# Altium schematic sheet COMMUNICATION.SchDoc
size 420 x 297 mm; SheetNumber: 4; SheetTotal: 7
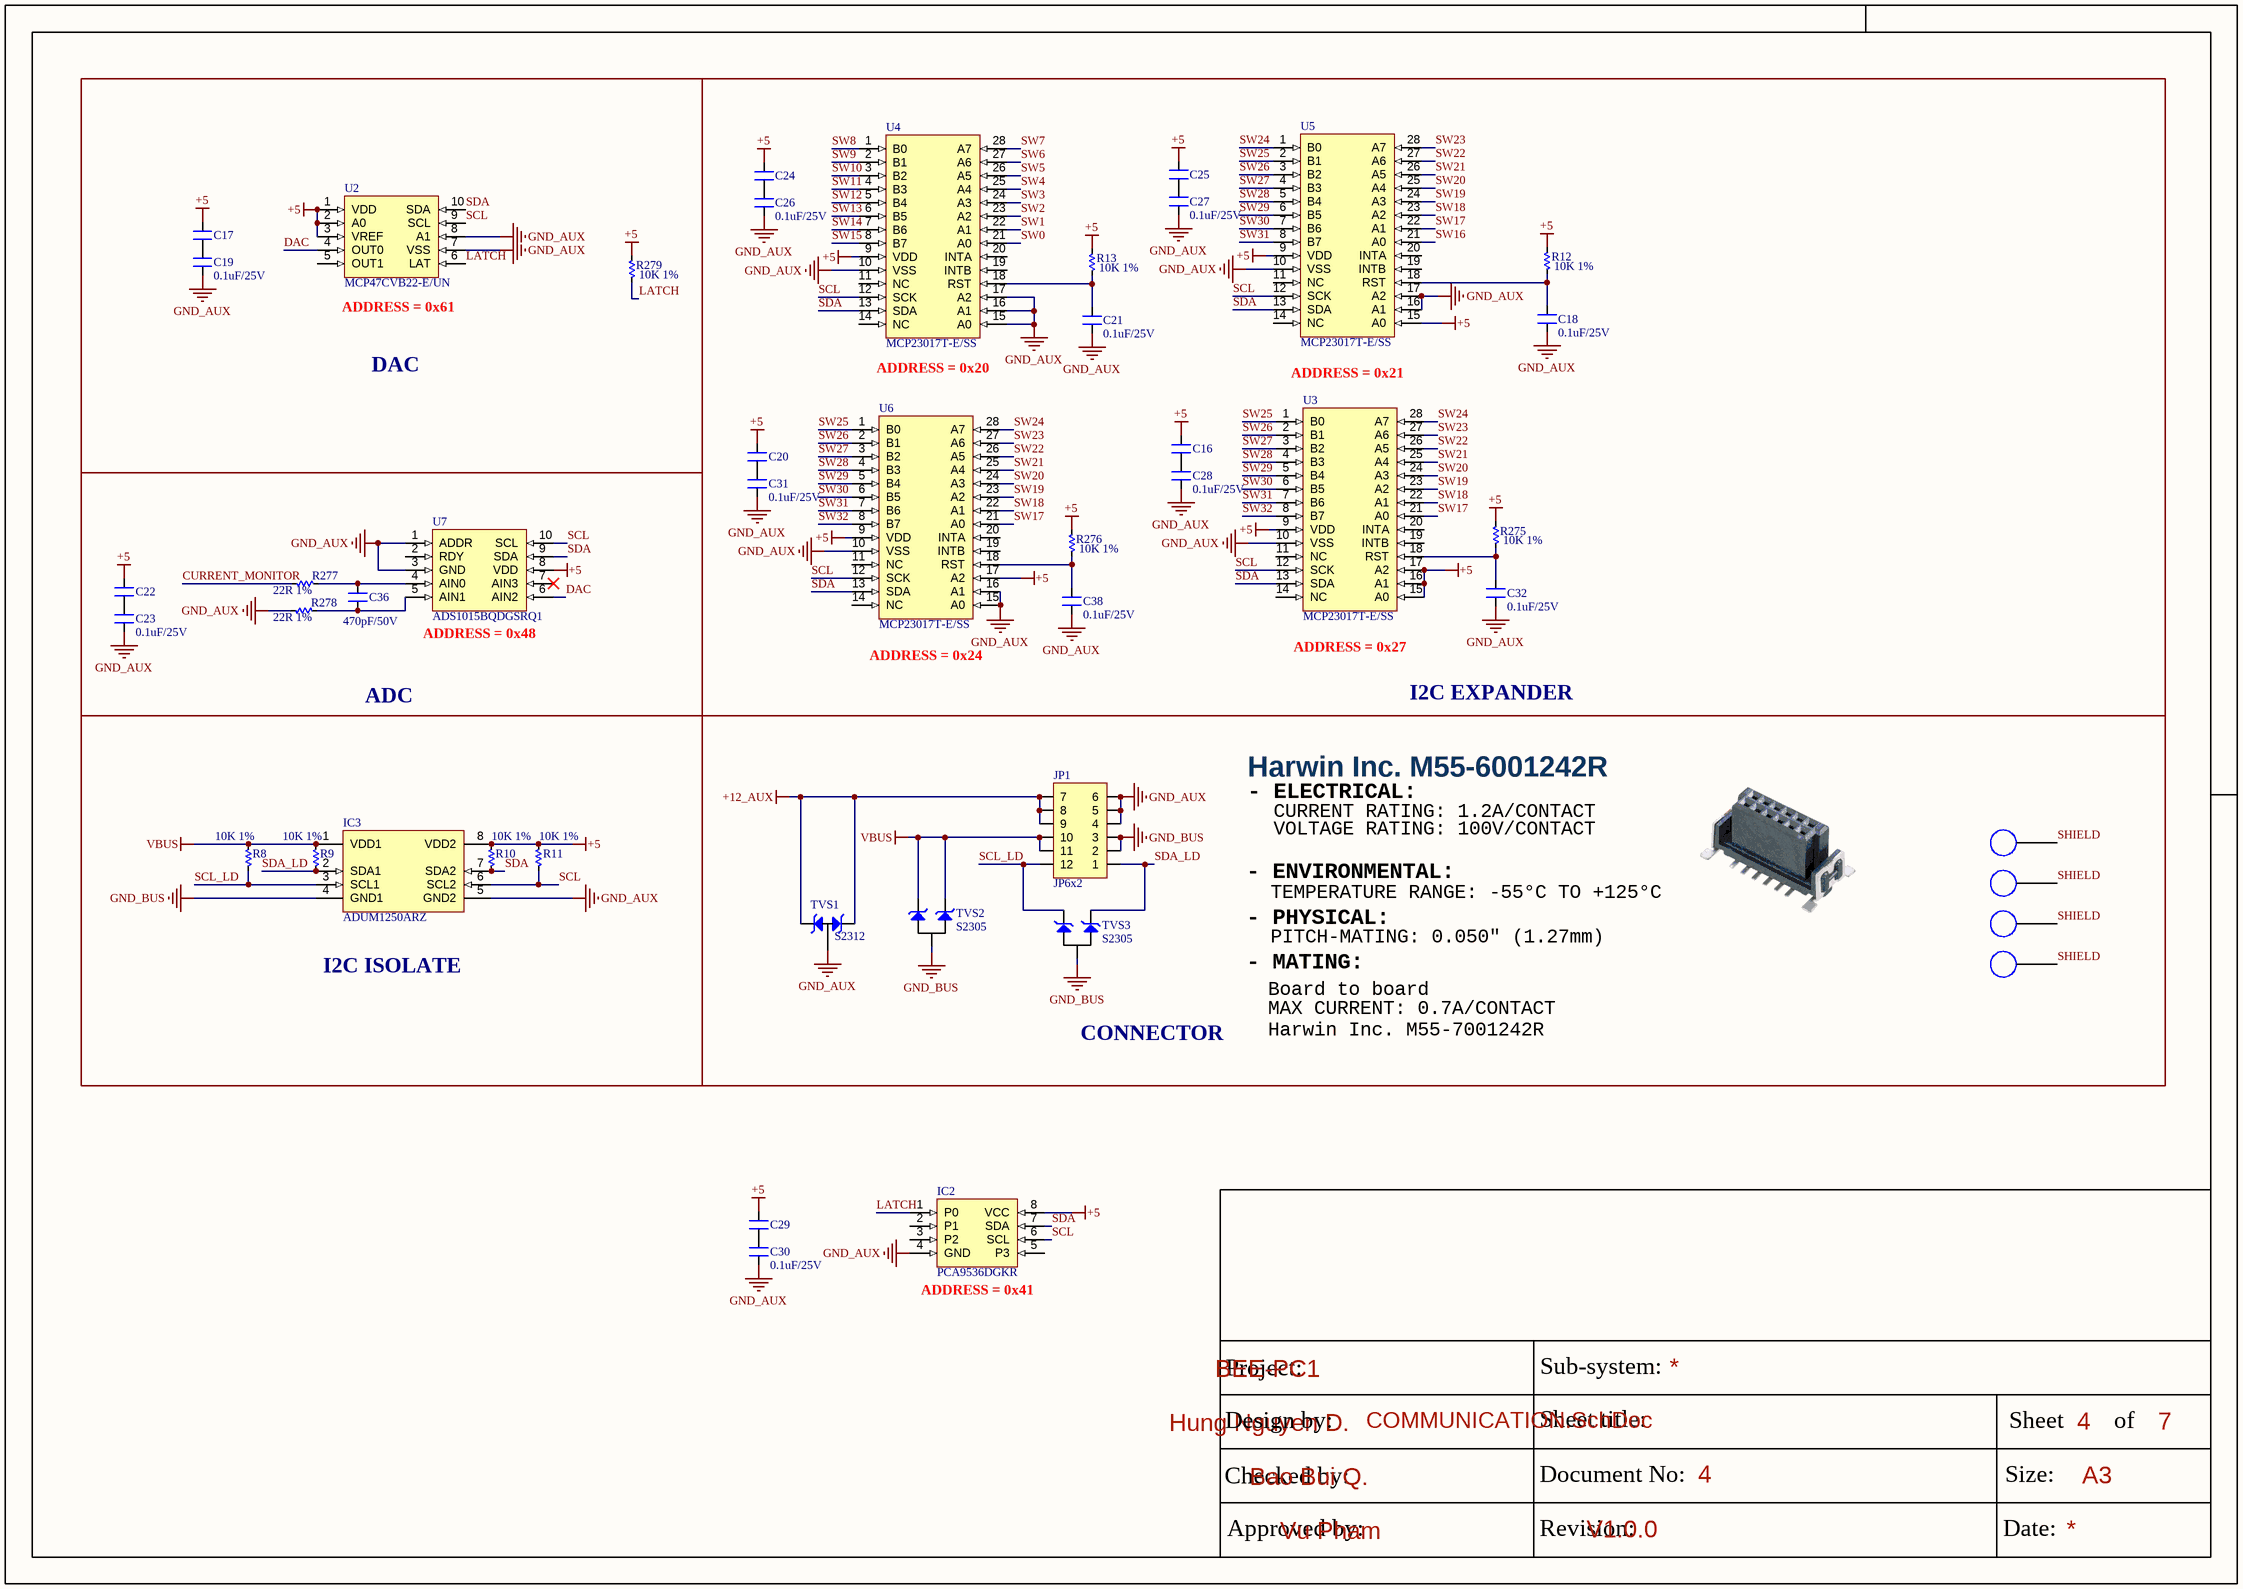
[diagram p0: COMMUNICATION.SchDoc]

## Parts
C16  0.1uF/25V  [SM-0603]  (value not drawn)
C17  0.1uF/25V  [SM-0603]  (value not drawn)
C18  0.1uF/25V  [SM-0603]
C19  0.1uF/25V  [SM-0603]
C20  0.1uF/25V  [SM-0603]  (value not drawn)
C21  0.1uF/25V  [SM-0603]
C22  0.1uF/25V  [SM-0603]  (value not drawn)
C23  0.1uF/25V  [SM-0603]
C24  0.1uF/25V  [SM-0603]  (value not drawn)
C25  0.1uF/25V  [SM-0603]  (value not drawn)
C26  0.1uF/25V  [SM-0603]
C27  0.1uF/25V  [SM-0603]
C28  0.1uF/25V  [SM-0603]
C29  0.1uF/25V  [SM-0603]  (value not drawn)
C30  0.1uF/25V  [SM-0603]
C31  0.1uF/25V  [SM-0603]
C32  0.1uF/25V  [SM-0603]
C36  470pF/50V  [SM-0603]
C38  0.1uF/25V  [SM-0603]
H1  M3  [M3]  (value not drawn)
H2  M3  [M3]  (value not drawn)
H3  M3  [M3]  (value not drawn)
H4  M3  [M3]  (value not drawn)
IC2  PCA9536DGKR  [TSSOP8]
IC3  ADUM1250ARZ  [SO8]
JP1  JP6x2  [M55-6001242R]
R8  10K 1%  [RES-SMD-0603]
R9  10K 1%  [RES-SMD-0603]
R10  10K 1%  [RES-SMD-0603]
R11  10K 1%  [RES-SMD-0603]
R12  10K 1%  [RES-SMD-0603]
R13  10K 1%  [RES-SMD-0603]
R275  10K 1%  [RES-SMD-0603]
R276  10K 1%  [RES-SMD-0603]
R277  22R 1%  [RES-SMD-0603]
R278  22R 1%  [RES-SMD-0603]
R279  10K 1%  [RES-SMD-0603]
TVS1  S2312  [SOT23-123]
TVS2  S2305  [SOT23-123]
TVS3  S2305  [SOT23-123]
U2  MCP47CVB22-E/UN  [MSOP10]
U3  MCP23017T-E/SS  [SSOP28]
U4  MCP23017T-E/SS  [SSOP28]
U5  MCP23017T-E/SS  [SSOP28]
U6  MCP23017T-E/SS  [SSOP28]
U7  ADS1015BQDGSRQ1  [VSSOP10]

## Blocks framed on the sheet
DAC: C17 C19 R279 U2
I2C EXPANDER: C16 C18 C20 C21 C24-C28 C31 C32 C38 R12 R13 R275 R276 U3-U6
ADC: C22 C23 C36 R277 R278 U7
I2C ISOLATE: IC3 R8-R11
Harwin Inc. M55-6001242R: H1-H4 JP1 TVS1-TVS3

## Nets
+5: C16.2 C17.2 C20.2 C22.2 C24.2 C25.2 C29.2 IC2.8(VCC) IC3.8(VDD2) R10.2 R11.2 R12.2 R13.2 R275.2 R276.2 R279.2 U2.1(VDD) U2.2(A0) U2.3(VREF) U3.9(VDD) U3.15(A0) U3.16(A1) U3.17(A2) U4.9(VDD) U5.9(VDD) U5.15(A0) U6.9(VDD) U6.17(A2) U7.8(VDD)
+12_AUX: JP1.7 JP1.8 JP1.9 TVS1.1 TVS1.3
GND_AUX: C18.1 C19.1 C21.1 C23.1 C26.1 C27.1 C28.1 C30.1 C31.1 C32.1 C38.1 IC2.4(GND) IC3.5(GND2) JP1.4 JP1.5 JP1.6 R278.2 TVS1.2 U2.7(VSS) U2.8(A1) U3.10(VSS) U4.10(VSS) U4.15(A0) U4.16(A1) U4.17(A2) U5.10(VSS) U5.16(A1) U5.17(A2) U6.10(VSS) U6.15(A0) U6.16(A1) U7.1(ADDR) U7.3(GND)
GND_BUS: IC3.4(GND1) JP1.2 JP1.3 TVS2.2 TVS3.2
VBUS: IC3.1(VDD1) JP1.10 JP1.11 R8.2 R9.2 TVS2.1 TVS2.3
CURRENT_MONITOR: R277.2
DAC: U2.4(OUT0) U7.6(AIN2)
LATCH: IC2.1(P0) R279.1 U2.6(LAT)
SCL: IC2.6(SCL) IC3.6(SCL2) R11.1 U2.9(SCL) U3.12(SCK) U4.12(SCK) U5.12(SCK) U6.12(SCK) U7.10(SCL)
SCL_LD: IC3.3(SCL1) JP1.12 R8.1 TVS3.3
SDA: IC2.7(SDA) IC3.7(SDA2) R10.1 U2.10(SDA) U3.13(SDA) U4.13(SDA) U5.13(SDA) U6.13(SDA) U7.9(SDA)
SDA_LD: IC3.2(SDA1) JP1.1 R9.1 TVS3.1
SHIELD: H1.1 H2.1 H3.1 H4.1
SW0: U4.21(A0)
SW1: U4.22(A1)
SW2: U4.23(A2)
SW3: U4.24(A3)
SW4: U4.25(A4)
SW5: U4.26(A5)
SW6: U4.27(A6)
SW7: U4.28(A7)
SW8: U4.1(B0)
SW9: U4.2(B1)
SW10: U4.3(B2)
SW11: U4.4(B3)
SW12: U4.5(B4)
SW13: U4.6(B5)
SW14: U4.7(B6)
SW15: U4.8(B7)
SW16: U5.21(A0)
SW17: U3.21(A0) U5.22(A1) U6.21(A0)
SW18: U3.22(A1) U5.23(A2) U6.22(A1)
SW19: U3.23(A2) U5.24(A3) U6.23(A2)
SW20: U3.24(A3) U5.25(A4) U6.24(A3)
SW21: U3.25(A4) U5.26(A5) U6.25(A4)
SW22: U3.26(A5) U5.27(A6) U6.26(A5)
SW23: U3.27(A6) U5.28(A7) U6.27(A6)
SW24: U3.28(A7) U5.1(B0) U6.28(A7)
SW25: U3.1(B0) U5.2(B1) U6.1(B0)
SW26: U3.2(B1) U5.3(B2) U6.2(B1)
SW27: U3.3(B2) U5.4(B3) U6.3(B2)
SW28: U3.4(B3) U5.5(B4) U6.4(B3)
SW29: U3.5(B4) U5.6(B5) U6.5(B4)
SW30: U3.6(B5) U5.7(B6) U6.6(B5)
SW31: U3.7(B6) U5.8(B7) U6.7(B6)
SW32: U3.8(B7) U6.8(B7)
NetC16_1: C16.1 C28.2
NetC17_1: C17.1 C19.2
NetC18_2: C18.2 R12.1 U5.18(RST)
NetC20_1: C20.1 C31.2
NetC21_2: C21.2 R13.1 U4.18(RST)
NetC22_1: C22.1 C23.2
NetC24_1: C24.1 C26.2
NetC25_1: C25.1 C27.2
NetC29_1: C29.1 C30.2
NetC32_2: C32.2 R275.1 U3.18(RST)
NetC36_1: C36.1 R278.1 U7.5(AIN1)
NetC36_2: C36.2 R277.1 U7.4(AIN0)
NetC38_2: C38.2 R276.1 U6.18(RST)

Not connected (* = marked no-connect by the designer): IC2 2(P1) 3(P2) 5(P3); U2 5(OUT1); U3 11(NC) 14(NC) 19(INTB) 20(INTA); U4 11(NC) 14(NC) 19(INTB) 20(INTA); U5 11(NC) 14(NC) 19(INTB) 20(INTA); U6 11(NC) 14(NC) 19(INTB) 20(INTA); U7 2(RDY) 7(AIN3)*

## Notes on the sheet
- (near U2) ADDRESS = 0x61
- ADDRESS = 0x20
- ADDRESS = 0x21
- (near U7) ADDRESS = 0x48
- (near U6) ADDRESS = 0x24
- (near U3) ADDRESS = 0x27
- - ELECTRICAL:
- CURRENT RATING: 1.2A/CONTACT
- VOLTAGE RATING: 100V/CONTACT
- - ENVIRONMENTAL:
- - PHYSICAL:
- TEMPERATURE RANGE: -55°C TO +125°C
- - MATING:
- Board to board
- PITCH-MATING: 0.050" (1.27mm)
- CONNECTOR
- MAX CURRENT: 0.7A/CONTACT
- Harwin Inc. M55-7001242R
- (near IC2) ADDRESS = 0x41
- Project:
- BEE-PC1
- Sub-system:
- Design by:
- Hung Nguyen D.
- Bao Bui Q.
- Sheet title:
- Sheet
- A3
- of
- Checked by:
- Approved by:
- Vu Pham
- Revision:
- Document No:
- V1.0.0
- Size:
- Date:

## Library data of the parts
C16-C32 C36 C38 = CM: 0603; Value: 103
IC2 = PCA9536
IC3 = ADUM1250
JP1 = JP6x2: WR-PHD 2.54 mm Dual Socket Header; Manufacturer: W¨¹rth Elektronik eiSos GmbH; partNo: 61301221821; ComponentLink1 Description: Manufacturer; ComponentLink2 Description: Datasheet; NoPins: 12; Created Date: 29 March 2013; ComponentLink1URL: http://www.we-online.com; ComponentLink2URL: http://katalog.we-online.de/em/datasheet/6130xx21821.pdf; Created by: Karrer Zheng
R8-R13 R275-R279 = Res-SMD: 0603; Manufacturer: Generic Components; Class: Passive; Published: 08/06/2000; Publisher: Altium Hobart Technology Centre
TVS1 = S2315: TVS DIODE 12VWM 19VC SOT23, P/N:  S2312
TVS2 TVS3 = S2303: TVS DIODE 5VWM 10.8VC SOT23, P/N: / S2305
U2 = MCP47CVB22
U3-U6 = MCP23017
U7 = ADS1015